# EAGLE board melzi (EAGLE 5.11)
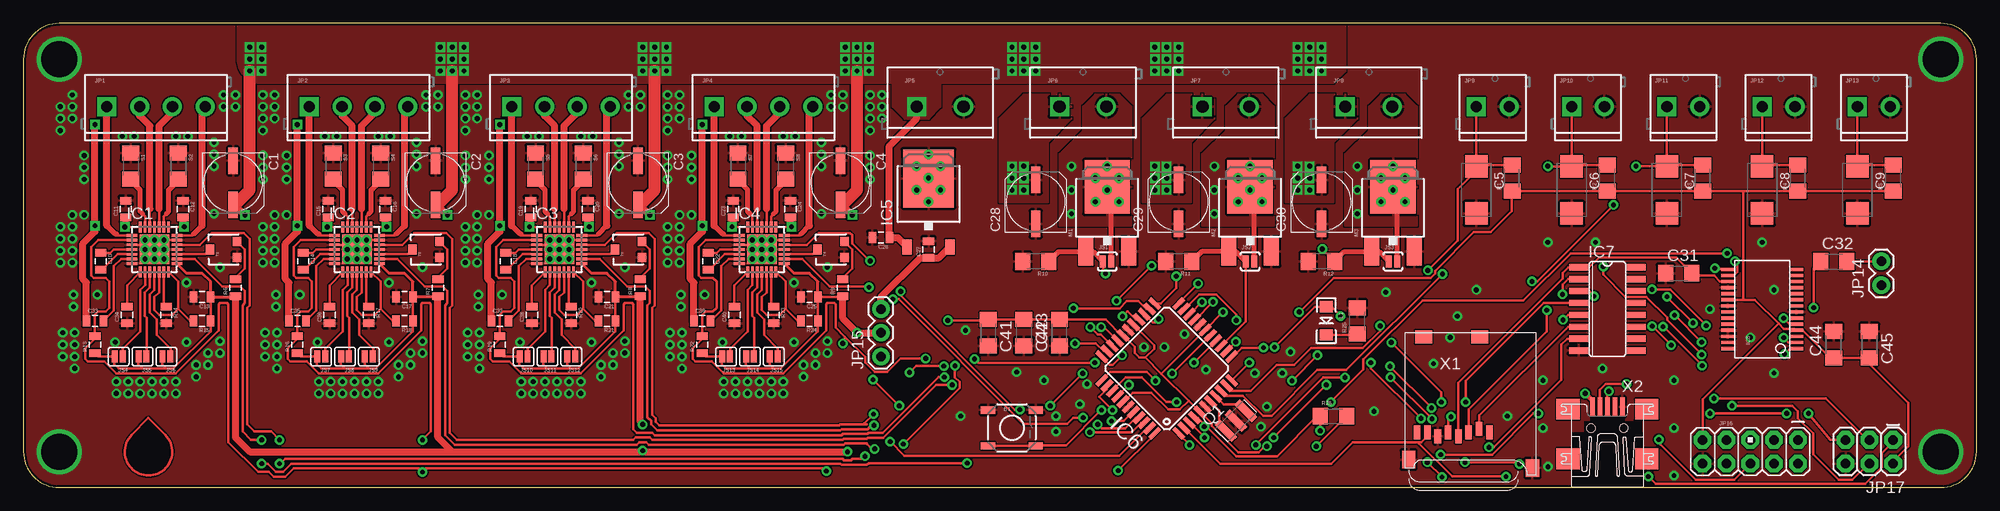
[diagram p1: board, top side]
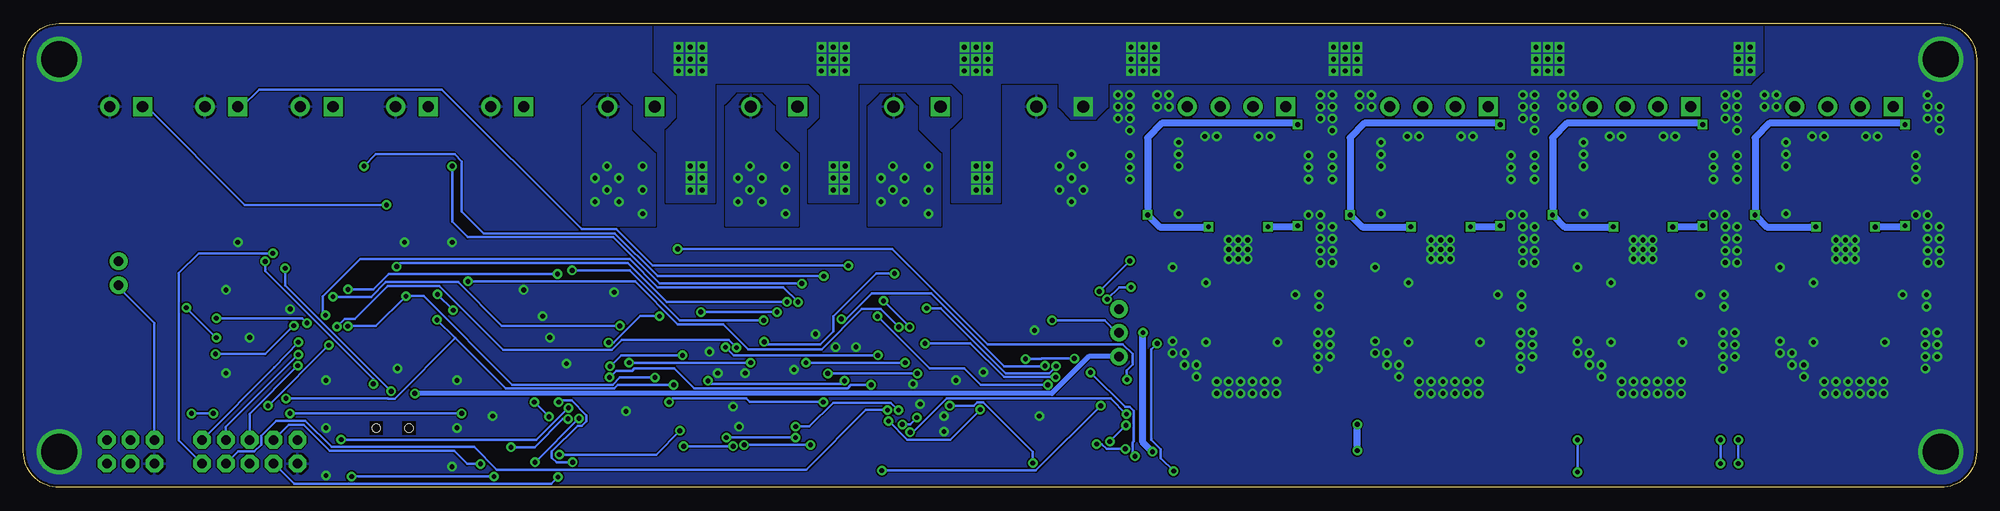
[diagram p2: board, bottom side, seen from below]

Size 208.28 x 49.53 mm. Coordinates in mm from the lower left corner, seen from the top.
Outline: 3.81,49.53 arc90 0,45.72 0,3.81 arc90 3.81,0 204.47,0 arc90 208.28,3.81 208.28,45.72 arc90 204.47,49.53 3.81,49.53
Copper layers (1*16): Top 0.035mm / dielectric 1.5mm / Bottom 0.035mm
Design rules "10width10space20drill10annular *": minimum track width 10mil, minimum drill 20mil, track to track 6mil, track to pad 6mil, pad to pad 7mil, via to via 6mil, smd to smd 0mil, copper to edge 10mil, drill to drill 10mil, minimum pad ring 10mil, minimum via ring 10mil, stop-mask expansion 2mil, vias tented up to drill 25mil, thermal gap 10mil
tRestrict: area 171.2,5.6 to 172.6,7.1; area 170,5.6 to 171.4,7.1; area 166.4,5.6 to 167.9,7.1
bRestrict: area 166.4,5.6 to 167.9,7.1; area 170,5.6 to 171.4,7.1

## Footprints (pad centres in the part's own frame; a part is rotated, then mirrored left to right if it is on the bottom)
TACTILE_SWITCH_SMD = smd 1.524 x 0.762: 1 -2.54,1.905; 2 2.54,1.905; 3 -2.54,-1.905; 4 2.54,-1.905
UD-6,3X7,7_NICHICON = smd 2.8 x 1: + 2.35,0; - -2.35,0
SMC_C = smd 2.4 x 2.4: + -2.5,0; - 2.5,0
0805 = smd 0.8 x 1.2: 1 -0.9,0; 2 0.9,0
C1206 = smd 1.6 x 1.8: 1 -1.4,0; 2 1.4,0
QFN28ET = smd 1.15 x 0.3: 1 -2.4,1.5; 2 -2.4,1; 3 -2.4,0.5; 4 -2.4,0; 5 -2.4,-0.5; 6 -2.4,-1; 7 -2.4,-1.5; 15 2.4,-1.5; 16 2.4,-1; 17 2.4,-0.5; 18 2.4,0; 19 2.4,0.5; 20 2.4,1; 21 2.4,1.5 | smd 0.3 x 1.15: 8 -1.5,-2.4; 9 -1,-2.4; 10 -0.5,-2.4; 11 0,-2.4; 12 0.5,-2.4; 13 1,-2.4; 14 1.5,-2.4; 22 1.5,2.4; 23 1,2.4; 24 0.5,2.4; 25 0,2.4; 26 -0.5,2.4; 27 -1,2.4; 28 -1.5,2.4 | smd 3.15 x 3.15: EXP 0,0
TO252 = smd 1 x 1.6: 1 -2.28,-4.8; 2 2.28,-4.8 | smd 5.4 x 6.2: 3 0,2.5
TQFP44 = smd 1.5 x 0.5: 1 -5.8,4; 2 -5.8,3.2; 3 -5.8,2.4; 4 -5.8,1.6; 5 -5.8,0.8; 6 -5.8,0; 7 -5.8,-0.8; 8 -5.8,-1.6; 9 -5.8,-2.4; 10 -5.8,-3.2; 11 -5.8,-4; 23 5.8,-4; 24 5.8,-3.2; 25 5.8,-2.4; 26 5.8,-1.6; 27 5.8,-0.8; 28 5.8,0; 29 5.8,0.8; 30 5.8,1.6; 31 5.8,2.4; 32 5.8,3.2; 33 5.8,4 | smd 0.5 x 1.5: 12 -4,-5.8; 13 -3.2,-5.8; 14 -2.4,-5.8; 15 -1.6,-5.8; 16 -0.8,-5.8; 17 0,-5.8; 18 0.8,-5.8; 19 1.6,-5.8; 20 2.4,-5.8; 21 3.2,-5.8; 22 4,-5.8; 34 4,5.8; 35 3.2,5.8; 36 2.4,5.8; 37 1.6,5.8; 38 0.8,5.8; 39 0,5.8; 40 -0.8,5.8; 41 -1.6,5.8; 42 -2.4,5.8; 43 -3.2,5.8; 44 -4,5.8
SO16 = smd 0.66 x 2.032: 1 -4.445,-3.073; 2 -3.175,-3.073; 3 -1.905,-3.073; 4 -0.635,-3.073; 5 0.635,-3.073; 6 1.905,-3.073; 7 3.175,-3.073; 8 4.445,-3.073; 9 4.445,3.073; 10 3.175,3.073; 11 1.905,3.073; 12 0.635,3.073; 13 -0.635,3.073; 14 -1.905,3.073; 15 -3.175,3.073; 16 -4.445,3.073
SSOP28DB = smd 0.348 x 1.397: 1 -4.225,-3.656; 2 -3.575,-3.656; 3 -2.925,-3.656; 4 -2.275,-3.656; 5 -1.625,-3.656; 6 -0.975,-3.656; 7 -0.325,-3.656; 8 0.325,-3.656; 9 0.975,-3.656; 10 1.625,-3.656; 11 2.275,-3.656; 12 2.925,-3.656; 13 3.575,-3.656; 14 4.225,-3.656; 15 4.225,3.656; 16 3.575,3.656; 17 2.925,3.656; 18 2.275,3.656; 19 1.625,3.656; 20 0.975,3.656; 21 0.325,3.656; 22 -0.325,3.656; 23 -0.975,3.656; 24 -1.625,3.656; 25 -2.275,3.656; 26 -2.925,3.656; 27 -3.575,3.656; 28 -4.225,3.656
SCREWTERMINAL-3.5MM-4 = drill 1.2 pad 2.032 square: 1 0,0 | drill 1.2 pad 2.032 round: 2 3.5,0; 3 7,0; 4 10.5,0
SCREWTERMINAL-5MM-2 = drill 1.3 pad 2.032 square: 1 0,0 | drill 1.3 pad 2.032 round: 2 5,0
SCREWTERMINAL-3.5MM-2 = drill 1.2 pad 2.032 square: 1 0,0 | drill 1.2 pad 2.032 round: 2 3.5,0
1X02 = drill 1.016 pad 1.88 round: 1 0,0; 2 2.54,0
1X03 = drill 1.016 pad 1.88 round: 1 0,0; 2 2.54,0; 3 5.08,0
AVR_ICSP = drill 1.016 pad 1.88 octagon: 1 -1.27,5.08; 2 1.27,5.08; 3 -1.27,2.54; 4 1.27,2.54; 5 -1.27,0; 6 1.27,0; 7 -1.27,-2.54; 8 1.27,-2.54; 9 -1.27,-5.08; 10 1.27,-5.08
2X3 = drill 1.016 pad 1.88 octagon: 1 0,0; 2 0,2.54; 3 2.54,0; 4 2.54,2.54; 5 5.08,0; 6 5.08,2.54
SJ_2S-NO = smd 0.635 x 1.27: 1 -0.45,0; 2 0.45,0
SJ_2S = smd 0.635 x 1.27: 1 -0.412,0; 2 0.412,0
LED-1206 = smd 1.2 x 1.4: A -1.5,0; C 1.5,0
DPAK = smd 1.6 x 3: 1 -2.28,-5.31; 3 2.28,-5.31 | smd 4.826 x 5.715: 4 0,1.588
CSTCR6M = smd 0.8 x 2.6: 1 -1.5,0; 2 0,0; 3 1.5,0
1206 = smd 1.6 x 1.8: 1 -1.4,0; 2 1.4,0
TRIMPOT-3MM = smd 1 x 0.9: 1 -0.85,-1.45; 3 0.85,-1.45 | smd 1.1 x 0.9: 2 0,1.45
MICROSD = smd 0.7 x 1.5: 1 9,-10.64; 2 7.9,-10.24; 3 6.8,-10.64; 4 5.7,-11.04; 5 4.6,-10.64; 6 3.5,-11.04; 7 2.4,-10.64; 8 1.3,-10.64 | smd 1.8 x 1.4: CD1 2,-0.44; CD2 8,-0.44 | smd 1.4 x 1.9: MT1 0.4,-13.54; MT2 13.6,-14.44
UX60-MB-5ST = smd 2 x 0.5: 1 2.25,1.6; 2 2.25,0.8; 3 2.25,0; 4 2.25,-0.8; 5 2.25,-1.6 | smd 2.2 x 2.5: M1 -3.3,-4.2; M2 -3.3,4.2; M3 2,4.2; M4 2,-4.2 | hole 0.9: 0,-1.75; 0,1.75

## Placement (x,y rotation side)
B1  RESET  [TACTILE_SWITCH_SMD]  105.41,6.35 0 top
C1  100 uF  [UD-6,3X7,7_NICHICON]  22.35,32.51 270 top
C2  100 uF  [UD-6,3X7,7_NICHICON]  43.94,32.51 270 top
C3  100 uF  [UD-6,3X7,7_NICHICON]  65.53,32.51 270 top
C4  100 uF  [UD-6,3X7,7_NICHICON]  87.12,32.51 270 top
C5  4.7 uF  [SMC_C]  154.94,31.75 270 top
C6  4.7 uF  [SMC_C]  165.1,31.75 270 top
C7  4.7 uF  [SMC_C]  175.26,31.75 270 top
C8  4.7 uF  [SMC_C]  185.42,31.75 270 top
C9  4.7 uF  [SMC_C]  195.58,31.75 270 top
C10  .1uf  [0805]  8.26,24.13 270 top
C11  .1uf  [0805]  10.92,29.72 90 top
C12  .1uf  [0805]  17.02,29.72 270 top
C13  .22uf  [0805]  19.05,20.32 180 top
C14  .1uf  [0805]  29.84,24.13 270 top
C15  .1uf  [0805]  32.51,29.72 90 top
C16  .1uf  [0805]  38.61,29.72 270 top
C17  .22uf  [0805]  40.64,20.32 180 top
C18  .1uf  [0805]  51.44,24.13 270 top
C19  .1uf  [0805]  54.1,29.72 90 top
C20  .1uf  [0805]  60.2,29.72 270 top
C21  .22uf  [0805]  62.23,20.32 180 top
C22  .1uf  [0805]  73.03,24.13 270 top
C23  .1uf  [0805]  75.69,29.72 90 top
C24  .1uf  [0805]  81.79,29.72 270 top
C25  .22uf  [0805]  83.82,20.32 180 top
C26  .33uf  [0805]  91.44,26.67 180 top
C27  .1uf  [0805]  96.52,25.4 90 top
C28  100 uF  [UD-6,3X7,7_NICHICON]  107.95,30.48 90 top
C29  100 uF  [UD-6,3X7,7_NICHICON]  123.19,30.48 90 top
C30  100 uF  [UD-6,3X7,7_NICHICON]  138.43,30.48 90 top
C31  0.1 uF  [C1206]  176.53,22.86 0 top
C32  0.1 uF  [C1206]  193.04,24.13 0 top
C33  .1uf  [0805]  7.62,17.78 0 top
C34  .22uf  [0805]  11.05,18.41 90 top
C35  .1uf  [0805]  29.21,17.78 0 top
C36  .22uf  [0805]  32.64,18.41 90 top
C37  .1uf  [0805]  50.8,17.78 0 top
C38  .22uf  [0805]  54.23,18.41 90 top
C39  .1uf  [0805]  72.39,17.78 0 top
C40  .22uf  [0805]  75.82,18.41 90 top
C41  1 uF  [C1206]  102.87,16.51 270 top
C42  1 uF  [C1206]  106.68,16.51 270 top
C43  0.1 uF  [C1206]  110.49,16.51 90 top
C44  0.1 uF  [C1206]  193.04,15.24 90 top
C45  0.33 uF  [C1206]  196.85,15.24 270 top
IC1  A4988  [QFN28ET]  13.97,25.4 0 top
IC2  A4988  [QFN28ET]  35.56,25.4 0 top
IC3  A4988  [QFN28ET]  57.15,25.4 0 top
IC4  A4988  [QFN28ET]  78.74,25.4 0 top
IC5  7805DT  [TO252]  96.52,30.48 0 top
IC6  ATMEGA644A  [TQFP44]  121.92,12.7 135 top
IC7  4050D  [SO16]  168.91,19.05 270 top
IC8  FT232RL-BASICSSOP  [SSOP28DB]  185.42,19.05 90 top
JP1  X-MOT  [SCREWTERMINAL-3.5MM-4]  8.89,40.64 0 top
JP2  Y-MOT  [SCREWTERMINAL-3.5MM-4]  30.48,40.64 0 top
JP3  Z-MOT  [SCREWTERMINAL-3.5MM-4]  52.07,40.64 0 top
JP4  Y-MOT  [SCREWTERMINAL-3.5MM-4]  73.66,40.64 0 top
JP5  PWR  [SCREWTERMINAL-5MM-2]  95.25,40.64 0 top
JP6  BED  [SCREWTERMINAL-5MM-2]  110.49,40.64 0 top
JP7  END  [SCREWTERMINAL-5MM-2]  125.73,40.64 0 top
JP8  FAN  [SCREWTERMINAL-5MM-2]  140.97,40.64 0 top
JP9  X-STOP  [SCREWTERMINAL-3.5MM-2]  154.94,40.64 0 top
JP10  Y-STOP  [SCREWTERMINAL-3.5MM-2]  165.1,40.64 0 top
JP11  Z-STOP  [SCREWTERMINAL-3.5MM-2]  175.26,40.64 0 top
JP12  BEDTEMP  [SCREWTERMINAL-3.5MM-2]  185.42,40.64 0 top
JP13  ENDTEMP  [SCREWTERMINAL-3.5MM-2]  195.58,40.64 0 top
JP14  AUTO-RST  [1X02]  198.12,21.59 90 top
JP15  VREG/USB  [1X03]  91.44,13.97 90 top
JP16  M05X2PTH  [AVR_ICSP]  184.15,3.81 270 top
JP17  AVR_SPI_PRG_6PTH  [2X3]  199.39,5.08 180 top
JS1  HOTBED_BYPASS  [SJ_2S-NO]  115.57,24.13 0 top
JS2  HOTEND_BYPASS  [SJ_2S-NO]  130.81,24.13 0 top
JS3  FAN_BYPASS  [SJ_2S-NO]  146.05,24.13 0 top
JS4  MS1  [SJ_2S]  10.16,13.97 180 top
JS5  MS2  [SJ_2S]  12.7,13.97 180 top
JS6  MS3  [SJ_2S]  15.24,13.97 180 top
JS7  MS1  [SJ_2S]  31.75,13.97 180 top
JS8  MS2  [SJ_2S]  34.29,13.97 180 top
JS9  MS3  [SJ_2S]  36.83,13.97 180 top
JS10  MS1  [SJ_2S]  53.34,13.97 180 top
JS11  MS2  [SJ_2S]  55.88,13.97 180 top
JS12  MS3  [SJ_2S]  58.42,13.97 180 top
JS13  MS1  [SJ_2S]  74.93,13.97 180 top
JS14  MS2  [SJ_2S]  77.47,13.97 180 top
JS15  MS3  [SJ_2S]  80.01,13.97 180 top
L1  DEBUG  [LED-1206]  138.94,17.78 270 top
M1  RFP30N06LE  [DPAK]  115.57,30.48 0 top
M2  RFP30N06LE  [DPAK]  130.81,30.48 0 top
M3  RFP30N06LE  [DPAK]  146.05,30.48 0 top
Q1  16MHZ  [CSTCR6M]  129.29,7.11 45 top
R1  10k  [1206]  158.75,33.02 90 top
R2  10k  [1206]  168.91,33.02 90 top
R3  10k  [1206]  179.07,33.02 90 top
R4  10k  [1206]  189.23,33.02 90 top
R5  10k  [1206]  199.39,33.02 90 top
R6  20k  [0805]  22.61,21.34 90 top
R7  20k  [0805]  44.2,21.34 90 top
R8  20k  [0805]  65.79,21.34 90 top
R9  20k  [0805]  87.38,21.34 90 top
R10  10k  [1206]  107.95,24.13 180 top
R11  10k  [1206]  123.19,24.13 180 top
R12  10k  [1206]  138.43,24.13 180 top
R13  100k  [0805]  7.62,15.24 90 top
R14  10k  [0805]  15.24,18.41 270 top
R15  10k  [0805]  19.05,17.78 180 top
R16  100k  [0805]  29.21,15.24 90 top
R17  10k  [0805]  36.83,18.41 270 top
R18  10k  [0805]  40.64,17.78 180 top
R19  100k  [0805]  50.8,15.24 90 top
R20  10k  [0805]  58.42,18.41 270 top
R21  10k  [0805]  62.23,17.78 180 top
R22  100k  [0805]  72.39,15.24 90 top
R23  10k  [0805]  80.01,18.41 270 top
R24  10k  [0805]  83.82,17.78 180 top
R25  1K  [1206]  142.24,17.78 90 top
R26  1K  [1206]  139.7,7.62 0 top
S1  0.05  [1206]  11.43,34.29 270 top
S2  0.05  [1206]  16.51,34.29 270 top
S3  0.05  [1206]  33.02,34.29 270 top
S4  0.05  [1206]  38.1,34.29 270 top
S5  0.05  [1206]  54.61,34.29 270 top
S6  0.05  [1206]  59.69,34.29 270 top
S7  0.05  [1206]  76.2,34.29 270 top
S8  0.05  [1206]  81.28,34.29 270 top
T1  TRIM  [TRIMPOT-3MM]  21.34,25.4 90 top
T2  TRIM  [TRIMPOT-3MM]  42.93,25.4 90 top
T3  TRIM  [TRIMPOT-3MM]  64.52,25.4 90 top
T4  TRIM  [TRIMPOT-3MM]  86.11,25.4 90 top
X1  MICROSD  [MICROSD]  147.32,16.51 0 top
X2  MINI-USB-SHIELD-UX60-MB-5ST  [UX60-MB-5ST]  168.91,6.35 90 top

## Tracks (layer width: path | path; a pad name or v marks a point on that pad's centre or on a via)
!FAN  (via drill 0.51)
  Top 0.254: v116.74,1.8 120.62,5.69 120.62,5.77 IC6.44 | v90.6,11.51 v93.4,8.71 | v138.51,25.45 139.65,24.31 R12.1
  Top 0.508: JS3.1 144.56,25.17 M3.1 140.87,25.17 R12.1
  Bottom 0.254: v116.74,1.8 100.31,1.8 v93.4,8.71 | v90.6,11.51 90.6,12.5 89.99,13.11 89.99,14.25 91.03,15.29 105.46,15.29 115.62,25.45 v138.51,25.45
!HOTBED  (via drill 0.51)
  Top 0.254: v129.29,15.54 128.29,14.55 IC6.13 | v115.39,22.84 115.14,23.09 115.14,23.9 JS1.1
  Top 0.508: JS1.1 114.08,25.17 M1.1 110.39,25.17 R10.1
  Bottom 0.254: v115.39,22.84 117.32,22.84 121.92,18.24 121.92,16.64 123.32,15.24 128.98,15.24 v129.29,15.54
!HOTEND
  Top 0.254: IC6.14 127.74,15.11 130.35,17.73 130.35,23.9 JS2.1
  Top 0.508: JS2.1 129.32,25.17 M2.1 125.63,25.17 R11.1
!RESET  (via drill 0.51)
  Top 0.254: B1.3 B1.4 108.05,4.52 111.23,4.52 v114.96,8.26 | 126.05,6.62 129.34,3.33 133.68,3.33 137.97,7.62 R26.1 138.28,7.52 v138.28,6.04 | 126.05,6.62 125.22,7.44 124.89,7.44 IC6.4 | v125.93,6.5 126.05,6.62 | JP17.5 192.66,5.08 v190.35,7.9 | v179.86,7.9 v188.04,7.9 | v161.54,7.9 161.01,7.9 156.62,3.5 v151.13,3.5
  Bottom 0.254: JP17.5 194.31,17.55 198.12,21.36 JP14.1 | v114.96,8.26 115.01,8.26 115.8,9.04 121.94,9.04 124.48,6.5 v125.93,6.5 | v188.04,7.9 v190.35,7.9 | v161.54,7.9 v179.86,7.9 | v151.13,3.5 140.82,3.5 v138.28,6.04
!XYEENABLE  (via drill 0.51, 0.51 pad 1.02)
  Top 0.254: IC2.2 29.57,26.4 28.83,25.65 28.83,22.61 29.08,22.35 30.35,22.35 30.73,21.97 30.73,19.18 30.35,18.8 29.59,18.8 29.21,18.41 R16.2 29.21,15.88 28.19,14.86 28.19,13.72 28.45,13.46 30.23,13.46 31.5,12.19 37.85,12.19 42.42,16.76 42.42,19.56 42.55,19.68 43.31,19.68 43.43,19.56 43.43,5.97 v42.55,5.08 | IC1.2 7.99,26.4 7.24,25.65 7.24,22.61 7.49,22.35 8.76,22.35 9.14,21.97 9.14,19.18 8.76,18.8 8,18.8 7.62,18.41 R13.2 7.62,15.88 6.6,14.86 6.6,13.72 6.86,13.46 8.64,13.46 9.91,12.19 16.26,12.19 20.83,16.76 20.83,19.56 20.95,19.68 21.72,19.68 21.84,19.56 21.84,4.83 25.02,1.65 26.16,1.65 26.67,1.14 27.94,1.14 28.83,2.03 42.16,2.03 v42.55,1.65 42.93,2.03 85.62,2.03 v85.62,1.75 | IC4.2 72.75,26.4 72.01,25.65 72.01,22.61 72.26,22.35 73.53,22.35 73.91,21.97 73.91,19.18 73.53,18.8 72.77,18.8 72.39,18.41 R22.2 72.39,15.88 71.37,14.86 71.37,13.72 71.63,13.46 73.41,13.46 74.68,12.19 81.03,12.19 85.6,16.76 85.6,19.56 85.72,19.68 86.49,19.68 86.61,19.56 86.61,17.07 87.59,16.09 | v124.82,13.31 127.15,15.65 IC6.15 | v114.25,13.31 101.83,13.31 v101.42,13.72 | v96.22,13.77 93.55,13.77 92.1,12.32 90.78,12.32 89.76,13.34 89.76,13.92 87.59,16.09 | v87.38,15.37 87.59,15.15 87.59,16.09
  Bottom 0.254: v42.55,1.65 v42.55,5.08 | v114.25,13.31 v124.82,13.31 | v101.42,13.72 99.72,13.72 99.67,13.77 v96.22,13.77 | v85.62,1.75 87,3.12 87,4.06 88.01,5.08 88.01,14.73 v87.38,15.37
!ZENABLE  (via drill 0.51)
  Top 0.254: IC3.2 51.16,26.4 50.42,25.65 50.42,22.61 50.67,22.35 51.94,22.35 52.32,21.97 52.32,19.18 51.94,18.8 51.18,18.8 50.8,18.41 R19.2 50.8,15.88 49.78,14.86 49.78,13.72 50.04,13.46 51.82,13.46 53.09,12.19 59.44,12.19 64.01,16.76 64.01,19.56 64.14,19.68 64.9,19.68 65.02,19.56 65.02,6.22 65.41,5.84 67.06,5.84 67.31,5.59 87.25,5.59 87.38,5.71 90.02,5.71 90.09,5.82 91.62,5.82 97.59,11.79 v98.2,11.79 | v112.14,15.37 114.38,15.37 115.19,14.55 115.55,14.55 IC6.32
  Bottom 0.254: v112.14,15.37 107.29,15.37 103.71,11.79 v98.2,11.79
AIFO  (via drill 0.51)
  Top 0.254: v187.81,14.25 188.37,14.81 189.05,14.81 IC8.1 | v179.45,17.27 175.59,21.13 v173.66,21.13 | v151.33,22.78 141.07,12.52 138,12.52 133.1,7.62 132.21,7.62 130.05,9.78 128.24,9.78 IC6.9 127.71,10.29
  Bottom 0.254: v187.81,14.25 182.47,14.25 v179.45,17.27 | v173.66,21.13 170.99,21.13 169.34,22.78 v151.33,22.78
AOFI  (via drill 0.51)
  Top 0.254: v187.71,18.06 188.32,17.45 189.05,17.45 IC8.5 | v175.26,20.34 v178.05,17.55 | v144.68,17.25 144.68,16.71 142.85,14.88 137.31,14.88 135.51,13.08 133.66,13.08 130.86,10.29 128.88,10.29 128.29,10.87 IC6.10
  Bottom 0.254: v187.71,18.06 178.56,18.06 v178.05,17.55 | v175.26,20.34 171.2,20.34 169.62,21.92 161.93,21.92 157.25,17.25 v144.68,17.25
BEDTEMP  (via drill 0.51)
  Top 0.254: JP12.1 C8.+ 185.42,34.42 R4.2 | v113.77,17.12 114.55,16.33 114.88,16.33 116.1,15.11 IC6.31 | v116.56,19.91 v120.32,23.67
  Bottom 0.254: v113.77,17.12 v116.56,19.91 | v120.32,23.67 141.17,23.67 145.06,27.56 148.77,27.56 163.68,42.47 183.16,42.47 184.99,40.64 JP12.1
DTR  (via drill 0.51)
  Top 0.254: v187.71,15.98 188.19,15.49 189.05,15.49 IC8.2 | v190.91,19.18 190.91,23.39 C32.1
  Bottom 0.254: v187.71,15.98 v190.91,19.18
E-DIR  (via drill 0.51)
  Top 0.254: IC4.19 83.56,25.9 84.84,27.18 88.14,27.18 88.39,26.92 88.39,26.04 90.17,24.26 90.27,24.18 v90.3,24.18 | v116.03,7.09 117.32,7.09 118.26,8.03 118.36,8.03 IC6.40 | v106.25,8.31 105.72,8.31 93.55,20.47 v93.55,20.93
  Bottom 0.254: v116.03,7.09 114.05,5.11 109.45,5.11 v106.25,8.31 | v90.3,24.18 v93.55,20.93
E-STEP  (via drill 0.51)
  Top 0.254: IC4.16 83.04,24.4 85.98,21.46 90.04,21.46 90.14,21.39 v90.17,21.36 | v114.55,6.73 114.99,6.3 117.47,6.3 118.62,7.44 118.95,7.44 IC6.41 | v113,7.44 111.94,7.44 111.3,6.81 106.63,6.81 93.34,20.09 v92.71,20.09
  Bottom 0.254: v114.55,6.73 113.72,6.73 v113,7.44 | v92.71,20.09 91.44,21.36 v90.17,21.36
ENDTEMP  (via drill 0.51)
  Top 0.254: JP13.1 C9.+ 195.58,34.42 R5.2 | v114.94,17.12 115.21,17.12 116.66,15.67 IC6.30 | v160.88,22 161.42,22 v169.57,30.15
  Bottom 0.254: v114.94,17.12 116.86,19.05 118.87,19.05 123.17,14.76 130.96,14.76 133.63,17.42 138.48,17.42 143.05,22 v160.88,22 | v169.57,30.15 184.66,30.15 195.15,40.64 JP13.1
EOUT1A
  Top 0.254: IC4.24 79.24,29.73
  Top 0.762: JP4.3 80.66,40.02 79.24,38.6 79.24,29.73
EOUT1B
  Top 0.254: IC4.21 82.78,26.9 82.93,27.05
  Top 0.508: 82.93,27.05 83.82,27.94
  Top 0.762: JP4.4 83.82,40.64 83.82,27.94
EOUT2A
  Top 0.254: IC4.26 78.24,29.73
  Top 0.762: JP4.2 77.16,39.68 78.24,38.6 78.24,29.73
EOUT2B
  Top 0.254: IC4.1 74.83,26.9 74.68,27.05
  Top 0.508: 74.68,27.05 74.55,27.05 73.66,27.94
  Top 0.762: 73.66,27.94 JP4.1
EXT-A1  (via drill 0.51)
  Top 0.254: v122.99,9.12 121.87,9.12 119.25,11.73 117.55,11.73 116.13,10.31 IC6.36 | v139.42,9.12 142.9,12.6 142.9,13.64 149.2,19.94 159.94,19.94 165,24.99 v181.69,24.99
  Bottom 0.254: v122.99,9.12 130.84,9.12 131.22,9.5 139.04,9.5 v139.42,9.12 | v181.69,24.99 189.59,24.99 191.69,22.89 191.69,5 JP16.2
EXT-A2  (via drill 0.51)
  Top 0.254: v116.13,8.26 114.73,9.65 114.73,9.68 115.55,10.49 115.55,10.85 IC6.35
  Bottom 0.254: v116.13,8.26 118.47,8.26 124.82,1.91 157.81,1.91 160.22,4.32 175.41,4.32 178.21,7.11 181.31,7.11 182.93,5.49 182.93,4.57 183.64,3.86 185.37,3.86 JP16.4
EXT-A3  (via drill 0.51)
  Top 0.254: v120.73,11.38 119.79,12.32 115.9,12.32 115.01,11.43 IC6.34 | v135.28,11.38 v138,14.1 | v145.72,12.93 v150.16,8.48 | v174.4,5.11 174.55,4.95 174.55,4.6 178.33,0.81 182.42,0.81 JP16.6
  Bottom 0.254: v138,14.1 144.55,14.1 v145.72,12.93 | v150.16,8.48 153.57,5.08 174.37,5.08 v174.4,5.11 | v135.28,11.38 134.95,11.05 121.06,11.05 v120.73,11.38
EXT-A4  (via drill 0.51)
  Top 0.254: v133.4,14.96 137.72,19.28 L1.A 139.04,19.2 139.55,19.2 v140.46,18.29 | v117.17,14.1 116.15,13.08 115.82,13.08 115.01,13.89 115.01,13.97 IC6.33 | v149.71,2.69 v151.28,1.12 | v151.21,9.12 151.21,10.13 v145.87,15.47
  Bottom 0.254: v133.4,14.96 132.54,14.1 v117.17,14.1 | JP16.8 181.53,2.54 179.38,0.38 152.02,0.38 v151.28,1.12 | v149.71,2.69 151.44,2.69 151.92,3.17 151.92,3.83 149.17,6.58 148.72,6.58 148.26,7.04 148.26,7.7 149.84,9.27 151.05,9.27 v151.21,9.12 | v145.87,15.47 145.34,15.47 142.52,18.29 v140.46,18.29
EXT-RX1  (via drill 0.51)
  Top 0.254: v130.73,13.31 IC6.11 | v143.69,13.31 143.69,12.72 v149.05,7.37 | v153.72,2.69 159.36,2.69 v159.54,2.52
  Bottom 0.254: v130.73,13.31 v143.69,13.31 | v149.05,7.37 v153.72,2.69 | v159.54,2.52 160.96,2.52 162.36,3.91 175.59,3.91 178.38,6.71 179.98,6.71 JP16.7
EXT-SCL  (via drill 0.51)
  Top 0.254: v126.85,19.81 124.99,17.96 124.89,17.96 IC6.19 | v168.48,23.57 168.48,22.71 170.84,20.34 173.08,20.34 175.28,18.14 175.28,17.86 v178.97,14.17
  Bottom 0.254: v126.85,19.81 139.68,19.81 143.81,23.95 168.1,23.95 v168.48,23.57 | v178.97,14.17 186.69,6.45 JP16.3
EXT-SDA  (via drill 0.51)
  Top 0.254: v125.68,19.79 124.41,18.52 124.33,18.52 IC6.20 | v176.07,18.39 v178.97,15.49
  Bottom 0.254: v125.68,19.79 127.25,21.36 140.61,21.36 143.61,24.36 172.36,24.36 176.35,20.37 176.35,18.67 v176.07,18.39 | v178.97,15.49 181.51,12.8 JP16.1
EXT-TX1  (via drill 0.51)
  Top 0.254: v132.23,14.91 129.95,14.91 129.03,13.99 128.85,13.99 IC6.12 | v174.85,17.17 v179.02,13.01
  Bottom 0.254: v132.23,14.91 133.07,15.75 144.47,15.75 145.54,14.68 157.1,14.68 163.93,21.51 169.44,21.51 172.95,18.01 174.01,18.01 v174.85,17.17 | v179.02,13.01 184.15,7.87 JP16.5
GND  (via drill 0.51 pad 1.02, 3.81 pad 1.02)
  Top 0.254: v12.95,25.4 12.45,25.9 IC1.3 | v14.99,26.42 16.38,26.42 | v34.54,25.4 34.04,25.9 IC2.3 | v36.58,26.42 37.97,26.42 | v77.72,25.4 77.22,25.9 IC4.3 | v79.76,26.42 81.15,26.42 81.15,26.41 IC4.20 | v56.13,25.4 55.63,25.9 IC3.3 | v58.17,26.42 59.56,26.42 | IC1.7 11.59,23.88
  other vias: 13.97,26.42 12.95,26.42 12.95,24.38 14.99,24.38 13.97,24.38 13.97,25.4 14.99,25.4 35.56,26.42 34.54,26.42 34.54,24.38 36.58,24.38 35.56,24.38 35.56,25.4 36.58,25.4 78.74,26.42 77.72,26.42 77.72,24.38 79.76,24.38 78.74,24.38 78.74,25.4 79.76,25.4 82.17,21.84 57.15,26.42 56.13,26.42 56.13,24.38 58.17,24.38 57.15,24.38 57.15,25.4 58.17,25.4 20.32,29.21 20.32,35.56 20.32,36.83 41.91,29.21 41.91,35.56 41.91,36.83 63.5,29.21 63.5,35.56 63.5,36.83 85.09,29.21 85.09,35.56 85.09,36.83 96.52,33.02 95.25,34.29 97.79,34.29 95.25,31.75 97.79,31.75 96.52,30.48 96.52,35.56 44.2,40.64 44.2,41.91 65.79,40.64 65.79,41.91 87.38,40.64 87.38,41.91 20.95,23.5 42.55,23.5 64.14,23.5 85.72,23.5 60.58,21.84 38.99,21.84 17.4,21.84 9.78,15.49 31.37,15.49 52.96,15.49 74.55,15.49 38.99,15.49 60.58,15.49 82.17,15.49 17.4,15.49 22.61,41.91 22.61,40.64 3.81,45.72 3.81,3.81 79.76,11.3 78.49,11.3 77.22,11.3 75.95,11.3 74.68,11.3 81.03,11.3 79.76,10.03 78.49,10.03 77.22,10.03 75.95,10.03 74.68,10.03 81.03,10.03 14.99,11.3 13.72,11.3 12.45,11.3 11.18,11.3 9.91,11.3 16.26,11.3 14.99,10.03 13.72,10.03 12.45,10.03 11.18,10.03 9.91,10.03 16.26,10.03 36.58,11.3 35.31,11.3 34.04,11.3 32.77,11.3 31.5,11.3 37.85,11.3 36.58,10.03 35.31,10.03 34.04,10.03 32.77,10.03 31.5,10.03 37.85,10.03 58.17,11.3 56.9,11.3 55.63,11.3 54.36,11.3 53.09,11.3 59.44,11.3 58.17,10.03 56.9,10.03 55.63,10.03 54.36,10.03 53.09,10.03 59.44,10.03 85.72,15.62 85.72,14.35 84.45,14.35 84.45,13.08 83.19,13.08 83.19,11.81 20.95,15.62 20.95,14.35 19.68,14.35 19.68,13.08 18.41,13.08 18.41,11.81 42.55,15.62 42.55,14.35 41.27,14.35 41.27,13.08 40.01,13.08 40.01,11.81 64.14,15.62 64.14,14.35 62.87,14.35 62.87,13.08 61.59,13.08 61.59,11.81 70.23,16.51 70.23,15.24 70.23,13.97 70.23,12.7 68.96,16.51 68.96,15.24 68.96,13.97 5.46,16.51 5.46,15.24 5.46,13.97 5.46,12.7 4.19,16.51 4.19,15.24 4.19,13.97 27.05,16.51 27.05,15.24 27.05,13.97 27.05,12.7 25.78,16.51 25.78,15.24 25.78,13.97 48.64,16.51 48.64,15.24 48.64,13.97 48.64,12.7 47.37,16.51 47.37,15.24 47.37,13.97 25.53,41.91 25.53,40.64 90.3,41.91 90.3,40.64 68.71,41.91 68.71,40.64 47.12,41.91 47.12,40.64 48.39,41.91 48.39,40.64 69.98,41.91 69.98,40.64 26.8,41.91 26.8,40.64 91.57,41.91 91.57,40.64 68.71,39.37 90.3,39.37 47.12,39.37 25.53,39.37 25.53,38.1 26.8,39.37 47.12,38.1 48.39,39.37 68.71,38.1 69.98,39.37 90.3,38.1 91.57,39.37 86.11,41.91 86.11,40.64 64.52,40.64 64.52,41.91 42.93,40.64 42.93,41.91 21.34,40.64 21.34,41.91 3.94,40.64 5.21,41.91 5.21,40.64 3.94,39.37 3.94,38.1 5.21,39.37 63.5,34.29 41.91,34.29 20.32,34.29 85.09,34.29 3.94,27.81 25.53,27.81 47.12,27.81 68.71,27.81 69.98,29.08 68.71,26.54 48.39,29.08 47.12,26.54 26.8,29.08 25.53,26.54 5.21,29.08 3.94,26.54 204.47,45.72 204.47,3.81 121.67,14.99 113.41,11.05 100.46,16.76 105.92,12.32 108.84,11.43 99.95,7.62 112.65,8.89 110.11,7.62 110.11,5.97 126.11,12.57 119.51,14.99 123.83,16.38 131.95,6.48 144.02,8.13 135.13,14.48 150.37,13.21 152.91,18.29 145.29,20.83 152.15,16 154.94,21.08 186.69,21.08 179.83,19.05 162.56,26.16 167.64,26.16 134.24,12.19 131.32,12.19 132.59,8.64 25.53,25.27 25.53,24 3.94,25.27 3.94,24 47.12,25.27 47.12,24 68.71,25.27 68.71,24 49.66,29.08 48.39,27.81 48.39,26.54 48.39,25.27 48.39,24 6.48,29.08 5.21,27.81 5.21,26.54 5.21,25.27 5.21,24 26.8,24 26.8,25.27 26.8,26.54 26.8,27.81 28.07,29.08 69.98,24 69.98,25.27 69.98,26.54 69.98,27.81 71.25,29.08 7.87,20.57 29.46,20.57 51.05,20.57 72.64,20.57 48.51,20.57 48.51,19.3 70.1,19.3 70.1,20.57 26.92,20.57 26.92,19.3 5.33,20.57 5.33,19.3 28.07,35.43 28.07,34.16 28.07,32.89 6.48,32.89 6.48,34.16 6.48,35.43 49.66,35.43 49.66,34.16 49.66,32.89 71.25,32.89 71.25,34.16 71.25,35.43 68.71,34.16 68.71,35.43 68.71,32.89 90.3,32.89 90.3,34.16 90.3,35.43 47.12,35.43 47.12,34.16 47.12,32.89 25.53,35.43 25.53,34.16 25.53,32.89 10.54,37.47 11.81,37.47 17.53,37.47 16.26,37.47 32.13,37.47 33.4,37.47 53.72,37.47 54.99,37.47 75.31,37.47 76.58,37.47 37.85,37.47 39.12,37.47 59.44,37.47 60.71,37.47 81.03,37.47 82.3,37.47 176.02,11.43 168.4,12.7 162.05,11.43 158.24,7.62 162.05,6.35 176.02,1.27 176.02,6.35 185.42,26.16 186.69,12.19 184.15,16 162.59,2.21
  pour Bottom (rank 6): -3.81,53.34 212.09,53.34 212.09,-3.81 -3.81,-3.81
  pour Top (rank 6): -5.08,54.61 -5.08,-5.08 165.1,-5.08 172.72,-5.08 213.36,-5.08 213.36,54.61
HOTBED-GND  (via drill 0.51 pad 1.02)
  Top 0.254: M1.4 116.02,31.62
  Top 0.508: JS1.2 116.02,29.66 v116.84,30.48
  other vias: 114.3,33.02 114.3,30.48 115.57,34.29 116.84,33.02 111.76,34.29 111.76,31.75 111.76,29.21 115.57,31.75
  pour Top: 118.11,27.94 110.49,27.94 110.49,35.56 113.03,38.1 113.03,40.64 114.3,41.91 116.84,41.91 118.11,40.64
  pour Bottom: 110.49,27.94 118.11,27.94 118.11,40.64 116.84,41.91 114.3,41.91 113.03,40.64 113.03,38.1 110.49,35.56
HOTBED-GND1  (via drill 0.51 pad 1.02)
  Top 0.254: M2.4 131.26,31.62
  Top 0.508: JS2.2 131.26,29.66 v132.08,30.48
  other vias: 130.81,34.29 129.54,33.02 132.08,33.02 129.54,30.48 127,34.29 127,31.75 127,29.21 130.81,31.75
  pour Top: 125.73,27.94 133.35,27.94 133.35,40.64 132.08,41.91 129.54,41.91 128.27,40.64 128.27,38.1 125.73,35.56
  pour Bottom: 125.73,27.94 133.35,27.94 133.35,40.64 132.08,41.91 129.54,41.91 128.27,40.64 128.27,38.1 125.73,35.56
HOTBED-GND2  (via drill 0.51 pad 1.02)
  Top 0.254: M3.4 146.5,31.62
  Top 0.508: JS3.2 146.5,29.66 v147.32,30.48
  other vias: 146.05,34.29 144.78,33.02 147.32,33.02 144.78,30.48 142.24,34.29 142.24,31.75 142.24,29.21 146.05,31.75
  pour Top: 148.59,27.94 140.97,27.94 140.97,35.56 143.51,38.1 143.51,40.64 144.78,41.91 147.32,41.91 148.59,40.64
  pour Bottom: 140.97,27.94 148.59,27.94 148.59,40.64 147.32,41.91 144.78,41.91 143.51,40.64 143.51,38.1 140.97,35.56
MISO  (via drill 0.51)
  Top 0.254: 148.79,4.83 149.07,4.83 149.71,5.46 149.71,5.87 X1.7 | 148.79,4.83 141.73,4.83 139.45,2.54 127.64,2.54 123.85,6.33 123.77,6.33 IC6.2 | JP17.1 199.39,4.85 198.17,3.63 198.17,2.13 196.42,0.38 174.07,0.38 v173.28,1.17 | v158.09,1.17 152.35,1.17 148.79,4.72 148.79,4.83
  Bottom 0.254: v158.09,1.17 v173.28,1.17
MOSI  (via drill 0.51)
  Top 0.254: v124.36,4.55 123.22,5.69 123.22,5.77 IC6.1 | v131.42,4.55 138.61,11.73 v140.92,11.73 | v167.49,20.42 166.95,20.95 IC7.3 | JP17.4 196.77,2.54 195.05,0.81 193.57,0.81 190.86,3.53 190.86,5.77 189.23,7.39 189.23,8.13 188.65,8.71 v182.19,8.71 | v173.69,17.22 v175.72,15.19
  Bottom 0.254: v124.36,4.55 v131.42,4.55 | v140.92,11.73 144.68,11.73 145.44,10.97 156.16,10.97 165.61,20.42 v167.49,20.42 167.59,20.34 170.71,17.22 v173.69,17.22 | v175.72,15.19 v182.19,8.71
N$1
  Top 0.254: 11.54,5.61 arc270 15.13,5.61 13.34,7.4 11.54,5.61
N$2
  Top 0.254: L1.C 142.16,16.28 142.24,16.36 R25.1
N$3
  Top 0.254: IC1.9 12.97,21.61 12.45,21.08 12.45,16.64 10.61,14.8 10.61,14.01 JS4.1
N$11
  Top 0.254: IC2.10 35.06,21.34 34.54,20.83 34.54,18.29 34.74,18.09 34.74,14.01 JS8.1
N$12  (via drill 0.51)
  Top 0.254: v162.46,18.92 162.46,16.66 154.13,8.33 154.13,5.89 X1.3 | v164.13,20.6 164.13,21.64 164.72,22.23 IC7.2
  Bottom 0.254: v162.46,18.92 v164.13,20.6
N$13  (via drill 0.51)
  Top 0.254: v152.22,7.54 151.94,7.26 151.94,5.89 X1.5 | v153.8,9.12 153.8,11.38 162.13,19.71 165.81,19.71 IC7.4
  Bottom 0.254: v152.22,7.54 v153.8,9.12
N$14
  Top 0.254: IC7.6 164.72,17.14 155.25,7.67 155.25,6.27 X1.2
N$15
  Top 0.762: IC5.2 97.62,24.5 C27.1 95.62,24.5 91.44,20.32 JP15.3
N$16
  Top 0.254: IC2.11 35.56,21.08 35.05,20.57 35.05,18.67 35.81,17.91 35.81,16.26 37.28,14.79 37.28,14.01 JS9.1
N$17
  Top 0.254: IC2.9 34.56,21.61 34.04,21.08 34.04,16.64 32.2,14.8 32.2,14.01 JS7.1
N$18
  Top 0.254: IC1.11 13.97,21.08 13.46,20.57 13.46,18.67 14.22,17.91 14.22,16.26 15.69,14.79 15.69,14.01 JS6.1
N$19
  Top 0.254: IC1.10 13.47,21.34 12.95,20.83 12.95,18.29 13.15,18.09 13.15,14.01 JS5.1
N$20
  Top 0.254: IC3.9 56.15,21.61 55.63,21.08 55.63,16.64 53.79,14.8 53.79,14.01 JS10.1
N$21
  Top 0.254: IC3.10 56.65,21.34 56.13,20.83 56.13,18.29 56.33,18.09 56.33,14.01 JS11.1
N$22
  Top 0.254: IC3.11 57.15,21.08 56.64,20.57 56.64,18.67 57.4,17.91 57.4,16.26 58.87,14.79 58.87,14.01 JS12.1
N$24
  Top 0.254: IC4.10 78.24,21.34 77.72,20.83 77.72,18.29 77.92,18.09 77.92,14.01 JS14.1
N$25
  Top 0.254: IC4.11 78.74,21.08 78.23,20.57 78.23,18.67 78.99,17.91 78.99,16.26 80.46,14.79 80.46,14.01 JS15.1
N$26
  Top 0.254: C32.2 JP14.2
N$27
  Top 0.254: IC4.9 77.74,21.61 77.22,21.08 77.22,16.64 75.38,14.8 75.38,14.01 JS13.1
N$28
  Top 0.254: IC6.7 127.51,8.24 127.51,6.86 128.22,6.14 Q1.1
N$29
  Top 0.254: 129.54,8.89 129.69,8.89 | 129.54,8.89 130.26,8.17 Q1.3 | IC6.8 127.99,8.89 129.54,8.89
SCLK  (via drill 0.51)
  Top 0.254: v125.96,5.33 124.41,6.88 124.33,6.88 IC6.3 | v133.32,5.33 v138.94,10.95 | v164.19,17.88 164.72,18.41 IC7.5 | JP17.3 196.62,5.08 192.2,9.5 v180.29,9.5
  Bottom 0.254: v125.96,5.33 v133.32,5.33 | v138.94,10.95 144.88,10.95 145.26,10.57 156.87,10.57 162.24,15.94 | 162.24,15.94 v164.19,17.88 | v180.29,9.5 169.42,9.5 169.39,9.47 168.71,9.47 162.24,15.94
SD-SS  (via drill 0.51)
  Top 0.254: v117.88,10.95 116.69,9.75 IC6.37 | v145.77,11.76 v150.22,7.32 | v156.29,4.29 156.82,4.29 164.01,11.48 164.01,15.24 164.64,15.88 IC7.7
  Bottom 0.254: v117.88,10.95 120.04,10.95 120.4,10.59 136.75,10.59 138.86,12.7 143.13,12.7 143.38,12.45 145.09,12.45 v145.77,11.76 | v150.22,7.32 150.75,7.32 153.77,4.29 v156.29,4.29
USBDM  (via drill 0.51)
  Top 0.254: v182.5,24.13 182.75,23.88 182.75,22.99 182.4,22.63 181.79,22.63 IC8.16 | v170.97,11.05 168.73,11.05 168.12,10.44 168.12,8.61 X2.2
  Bottom 0.254: v182.5,24.13 182.5,23.11 170.97,11.58 v170.97,11.05
USBDP  (via drill 0.51)
  Top 0.254: v180.37,23.39 180.47,23.29 181.76,23.29 IC8.15 | v169.06,10.26 168.88,10.08 168.88,8.64 168.91,8.61 X2.3
  Bottom 0.254: v180.37,23.39 180.37,21.57 v169.06,10.26
UVCC  (via drill 0.51)
  Top 0.254: 167.34,9.25 167.34,8.61 X2.1
  Top 0.483: v166.55,10.03 167.34,9.25
  Bottom 0.508: v166.55,10.03 98.6,10.03 94.67,13.97 JP15.1
VCC  (via drill 0.51, 0.51 pad 1.02)
  Top 0.254: R15.1 C13.1 | 12.7,12.7 10.16,12.7 9.71,13.15 9.71,13.93 JS4.2 7.99,13.97 R13.1 | 12.7,12.7 15.24,12.7 | R15.1 19.95,17.41 | 12.7,12.7 12.25,13.15 12.25,13.93 JS5.2 | 15.24,12.7 14.79,13.15 14.79,13.93 JS6.2 | 15.24,12.7 16,12.7 19.95,16.65 R15.1 | C17.1 R18.1 | 34.29,12.7 31.75,12.7 31.3,13.15 31.3,13.93 JS7.2 29.58,13.97 R16.1 | 36.83,12.7 34.29,12.7 | R18.1 41.54,17.41 | 34.29,12.7 33.84,13.15 33.84,13.93 JS8.2 | 36.83,12.7 36.38,13.15 36.38,13.93 JS9.2 | 36.83,12.7 37.59,12.7 41.54,16.65 R18.1 | C21.1 R21.1 | 55.88,12.7 53.34,12.7 52.89,13.15 52.89,13.93 JS10.2 51.17,13.97 R19.1 | 58.42,12.7 55.88,12.7 | R21.1 63.13,17.41 | 55.88,12.7 55.43,13.15 55.43,13.93 JS11.2 | 58.42,12.7 57.97,13.15 57.97,13.93 JS12.2 | 58.42,12.7 59.18,12.7 63.13,16.65 R21.1 | R24.1 C25.1 87.26,20.32 R9.1 | 77.47,12.7 74.93,12.7 74.48,13.15 74.48,13.93 JS13.2 72.76,13.97 R22.1 | 80.01,12.7 77.47,12.7 | R24.1 84.72,17.41 | 77.47,12.7 77.02,13.15 77.02,13.93 JS14.2 | 80.01,12.7 79.56,13.15 79.56,13.93 JS15.2 | 80.01,12.7 80.77,12.7 84.72,16.65 R24.1 | 119.65,13.86 121.36,12.14 | 121.36,12.14 124.24,9.26 | 124.24,9.26 125.45,8.05 IC6.5 125.55,8 126.72,6.83 126.72,6.58 129.54,3.76 131.75,3.76 132.38,4.39 v132.59,4.39 | IC6.38 117.27,9.17 117.37,9.17 118.31,10.11 120.29,10.11 122.07,8.33 123.32,8.33 124.24,9.26 | 118.39,17.25 118.39,17.35 IC6.27 120.6,15.15 120.6,14.81 119.65,13.86 | 121.36,12.14 IC6.17 126.09,16.89 v127.91,18.72 | v137.87,4.39 R26.2 | v98.58,17.83 102.77,17.83 C41.1 C42.1 106.78,17.91 C43.2 110.59,17.91 115.42,17.91 117.14,16.18 IC6.29 117.27,16.23 118.49,15.01 118.49,14.35 118.99,13.86 119.65,13.86
  Top 0.254: R3.1 179.17,31.62 | 183.39,31.62 R4.1 189.33,31.62 R5.1 | 183.39,20.02 184.63,20.02 187.16,17.49 | 183.39,20.02 181.79,20.02 IC8.20 | 187.16,17.49 187.73,16.92 188.85,16.92 188.95,16.82 IC8.4 189.08,16.76 189.76,16.76 192.68,13.84 C44.1 193.14,13.84 C45.2 196.29,13.74 201.02,9.02 201.02,4.39 199.39,2.77 JP17.2 | JP16.9 179.07,9.4 187.16,17.49 | 183.39,31.62 183.39,20.02 | v136.04,18.72 136.09,18.72 139.75,22.38 150.09,22.38 150.55,22.84 150.55,23.11 154.69,27.25 156.46,27.25 158.7,29.49 158.7,31.5 R1.1 R2.1 169.01,31.62 R3.1 | R3.1 183.39,31.62
  Top 0.305: IC1.15 17.41,22.86 19.05,22.86 19.95,21.96 C13.1 22.49,20.32 R6.1 | IC2.15 39,22.86 40.64,22.86 41.54,21.96 C17.1 44.08,20.32 R7.1 | IC3.15 60.59,22.86 62.23,22.86 63.13,21.96 C21.1 65.67,20.32 R8.1 | IC4.15 82.18,22.86 83.82,22.86 84.72,21.96 C25.1
  Top 0.762: 45.72,3.81 24.13,3.81 22.61,5.33 R6.1 | R7.1 44.2,5.33 45.72,3.81 | R8.1 65.79,6.99 v66.04,6.73 | R9.1 87.38,18.03 v88.9,16.51 JP15.2 | 45.72,3.81 65.91,3.81 v66.04,3.94 66.17,3.81 v87.88,3.81
  Bottom 0.254: v132.59,4.39 v137.87,4.39 | v98.58,17.83 92.99,17.83 91.67,16.51 JP15.2 | v127.91,18.72 v136.04,18.72
  Bottom 0.762: v66.04,3.94 v66.04,6.73 | v88.9,16.51 88.9,4.83 v87.88,3.81
VDD
  Top 0.254: IC8.17 181.76,22 180.9,22 180.29,22.61 178.21,22.61 177.95,22.86 C31.2 177.88,22.96 176.28,24.56 168.02,24.56 166.98,23.52 165.94,23.52 IC7.1 164.72,23.5 164.13,22.91 164.13,22.3 153.01,11.18 153.01,5.49 X1.4
VMOT  (via drill 0.51 pad 1.02)
  Top 0.254: IC1.28 v10.81,27.8 10.79,27.81 | IC1.22 v17.13,27.8 v17.14,27.81 | IC2.22 v38.72,27.8 v38.73,27.81 | IC3.28 v53.99,27.8 v53.98,27.81 | IC3.22 60.31,27.8 v60.33,27.81 | IC4.28 75.58,27.8 v75.56,27.81 | IC4.22 81.9,27.8 v81.92,27.81 | C15.1 32.16,28.8 | v32.4,27.8 IC2.28
  Top 0.762: C11.1 10.92,27.94 10.79,27.81 | C12.2 17.02,27.94 v17.14,27.81 | C33.1 6.71,17.77 6.71,21.87 6.35,22.23 6.35,26.04 7.62,27.3 v7.62,27.94 v7.62,38.73 | C16.2 38.61,27.94 v38.73,27.81 | 28.3,17.77 C35.1 28.31,21.86 27.94,22.23 27.94,26.04 29.21,27.3 v29.21,27.94 v29.21,38.73 | C19.1 54.1,27.94 v53.98,27.81 | C20.2 60.2,27.94 v60.33,27.81 | 49.89,17.77 C37.1 49.9,21.86 49.53,22.23 49.53,26.04 50.8,27.3 v50.8,27.94 v50.8,38.73 | C23.1 75.69,27.94 v75.56,27.81 | C24.2 81.79,27.94 v81.92,27.81 | 71.48,17.77 C39.1 71.49,21.86 71.12,22.23 71.12,26.04 72.39,27.3 v72.39,27.94 v72.39,38.73 | v23.62,29.08 22.54,30.16 C1.+ | v45.21,29.08 44.13,30.16 C2.+ | v66.8,29.08 65.72,30.16 C3.+ | v88.39,29.08 87.31,30.16 C4.+ | JP5.1 95.25,39.37 92.34,36.46 C26.1 93.25,26.67 IC5.1 | v32.4,27.8 32.4,28.7 C15.1
  Top 1.27: 44.13,30.16 45.72,31.75 v45.72,44.45 | 65.72,30.16 67.31,31.75 v67.31,44.45 | 87.31,30.16 88.9,31.75 v88.9,44.45 | 22.54,30.16 24.13,31.75 v24.13,44.45
  Bottom 0.254: v10.81,27.8 10.82,27.84 10.79,27.81
  Bottom 0.762: v17.14,27.81 22.35,27.81 v23.62,29.08 23.62,37.34 22.1,38.86 7.75,38.86 v7.62,38.73 | 10.79,27.81 7.75,27.81 v7.62,27.94 | v38.73,27.81 43.94,27.81 v45.21,29.08 45.21,37.34 43.69,38.86 29.34,38.86 v29.21,38.73 | v60.33,27.81 65.53,27.81 v66.8,29.08 66.8,37.34 65.28,38.86 50.93,38.86 v50.8,38.73 | v53.98,27.81 50.93,27.81 v50.8,27.94 | v81.92,27.81 87.12,27.81 v88.39,29.08 88.39,37.34 86.87,38.86 72.52,38.86 v72.39,38.73 | v75.56,27.81 72.52,27.81 v72.39,27.94 | v32.4,27.8 29.35,27.8 v29.21,27.94
  other vias: 24.13,45.72 24.13,46.99 45.72,45.72 45.72,46.99 67.31,45.72 67.31,46.99 88.9,45.72 88.9,46.99 25.4,46.99 25.4,45.72 25.4,44.45 44.45,46.99 46.99,45.72 44.45,45.72 44.45,44.45 46.99,46.99 46.99,44.45 66.04,46.99 66.04,45.72 66.04,44.45 68.58,44.45 68.58,45.72 68.58,46.99 87.63,46.99 87.63,45.72 87.63,44.45 90.17,44.45 90.17,45.72 90.17,46.99 107.95,44.45 105.41,44.45 106.68,44.45 107.95,45.72 106.68,45.72 105.41,45.72 105.41,46.99 106.68,46.99 107.95,46.99 120.65,44.45 121.92,44.45 123.19,44.45 123.19,45.72 121.92,45.72 120.65,45.72 120.65,46.99 121.92,46.99 123.19,46.99 138.43,46.99 137.16,45.72 138.43,45.72 138.43,44.45 137.16,44.45 135.89,44.45 137.16,46.99 135.89,46.99 135.89,45.72 105.41,34.29 105.41,33.02 105.41,31.75 120.65,31.75 120.65,33.02 120.65,34.29 135.89,34.29 135.89,33.02 135.89,31.75 137.16,33.02 137.16,34.29 137.16,31.75 121.92,34.29 121.92,33.02 121.92,31.75 106.68,34.29 106.68,33.02 106.68,31.75
  pour Top (no thermals): 22.86,52.07 22.86,45.72 arc90 25.4,43.18 92.71,43.18 92.71,40.64 93.98,39.37 96.52,39.37 97.79,40.64 97.79,43.18 139.7,43.18 140.97,44.45 140.97,52.07
  pour Bottom (no thermals): 140.97,50.8 22.86,50.8 22.86,44.45 24.13,43.18 92.71,43.18 92.71,40.64 93.98,39.37 96.52,39.37 97.79,40.64 97.79,43.18 104.14,43.18 104.14,30.48 109.22,30.48 109.22,38.1 107.95,39.37 107.95,41.91 109.22,43.18 119.38,43.18 119.38,30.48 124.46,30.48 124.46,38.1 123.19,39.37 123.19,41.91 124.46,43.18 134.62,43.18 134.62,30.48 139.7,30.48 139.7,38.1 138.43,39.37 138.43,41.91 140.97,44.45
  pour Top: 104.14,30.48 109.22,30.48 109.22,36.83 111.76,39.37 111.76,41.91 106.68,41.91 104.14,39.37
  pour Top: 119.38,30.48 124.46,30.48 124.46,36.83 127,39.37 127,41.91 121.92,41.91 119.38,39.37
  pour Top: 134.62,30.48 139.7,30.48 139.7,36.83 142.24,39.37 142.24,41.91 137.16,41.91 134.62,39.37
X-DIR  (via drill 0.51, 0.51 pad 1.02)
  Top 0.254: IC1.19 18.79,25.9 20.07,27.18 23.5,27.18 24.13,26.54 24.13,19.43 23.88,19.18 23.88,6.73 24.64,5.97 26.42,5.97 v27.3,5.08 | v27.3,2.54 27.43,2.54 27.94,3.05 87.38,3.05 87.5,2.92 88.27,2.92 88.39,3.05 89.46,3.05 v89.74,3.33 | v111.96,19.13 116.89,19.13 117.65,19.89 118.9,19.89 119.71,19.07 120.07,19.07 IC6.24 | v98.15,12.95 95.2,12.95 94.51,12.27 v94.49,12.27
  Bottom 0.254: v27.3,2.54 v27.3,5.08 | 94.79,12.27 v94.49,12.27 94.39,12.19 90.81,8.61 90.32,8.61 89.86,8.15 89.86,4.93 89.97,4.83 89.97,3.56 v89.74,3.33 | v111.96,19.13 110.47,19.13 103.53,12.19 98.91,12.19 v98.15,12.95
X-STEP  (via drill 0.51, 0.51 pad 1.02)
  Top 0.254: IC1.16 18.27,24.4 21.21,21.46 23.11,21.46 23.62,20.95 23.62,19.68 23.37,19.43 23.37,5.97 24.26,5.08 v25.4,5.08 | v25.4,2.54 26.04,2.54 26.92,1.65 27.69,1.65 28.57,2.54 87.12,2.54 87.25,2.41 89.94,2.41 90.12,2.59 v100.64,2.59 | v122.5,12.17 126.57,16.23 IC6.16 | v109.5,8.71 v112.95,12.17
  Bottom 0.254: v25.4,2.54 v25.4,5.08 | v112.95,12.17 v122.5,12.17 | v109.5,8.71 106.96,8.71 106.58,9.09 105.92,9.09 100.64,3.81 v100.64,2.59
X-STOP  (via drill 0.51)
  Top 0.254: C5.+ JP9.1 | v129.34,17.83 129.34,18.44 127.18,20.6 125.37,20.6 123.85,19.07 123.77,19.07 IC6.21 | v149.76,23.16 152.93,26.34 152.93,31.83 154.89,33.78 154.89,34.14 C5.+ | R1.2 155.04,34.42 C5.+
  Bottom 0.254: v129.34,17.83 138.28,17.83 143.61,23.16 v149.76,23.16
XCP1
  Top 0.254: IC1.4 9.65,25.4 9.28,25.03 C10.1
XCP2
  Top 0.254: IC1.5 10.04,24.9 8.37,23.23 C10.2
XCP3
  Top 0.254: IC2.4 31.24,25.4 30.87,25.03 C14.1
XCP4
  Top 0.254: IC2.5 31.63,24.9 29.96,23.23 C14.2
XCP5
  Top 0.254: IC3.4 52.83,25.4 52.46,25.03 C18.1
XCP6
  Top 0.254: IC3.5 53.22,24.9 51.55,23.23 C18.2
XCP7
  Top 0.254: IC4.4 74.3,25.4 73.92,25.03 C22.1
XCP8
  Top 0.254: IC4.5 74.81,24.9 73.14,23.23 C22.2
XOUT1A
  Top 0.254: IC1.24 14.47,29.73
  Top 0.762: JP1.3 15.89,40.02 14.47,38.6 14.47,29.73
XOUT1B
  Top 0.254: IC1.21 18.01,26.9 18.16,27.05
  Top 0.508: 18.16,27.05 19.05,27.94
  Top 0.762: JP1.4 19.05,40.64 19.05,27.94
XOUT2A
  Top 0.254: IC1.26 13.47,29.73
  Top 0.762: JP1.2 12.39,39.68 13.47,38.6 13.47,29.73
XOUT2B
  Top 0.254: IC1.1 10.06,26.9 9.91,27.05
  Top 0.508: 9.91,27.05 9.78,27.05 8.89,27.94
  Top 0.762: 8.89,27.94 JP1.1
XREF
  Top 0.254: IC1.17 19.39,24.9 T1.2
XREF1
  Top 0.254: IC2.17 40.98,24.9 T2.2
XREF2
  Top 0.254: T1.3 23.62,25.41 23.62,23.37 22.61,22.35 R6.2
XREF3
  Top 0.254: T2.3 45.21,25.41 45.21,23.37 44.2,22.35 R7.2
XREF4
  Top 0.254: IC3.17 62.57,24.9 T3.2
XREF5
  Top 0.254: T3.3 66.8,25.41 66.8,23.37 65.79,22.35 R8.2
XREF6
  Top 0.254: IC4.17 84.16,24.9 T4.2
XREF7
  Top 0.254: T4.3 88.39,25.41 88.39,23.37 87.38,22.35 R9.2
XROSC
  Top 0.254: R14.1 14.97,19.59 IC1.13
XROSC1
  Top 0.254: R17.1 36.56,19.59 IC2.13
XROSC2
  Top 0.254: R20.1 58.15,19.59 IC3.13
XROSC3
  Top 0.254: R23.1 79.74,19.59 IC4.13
XSENSE1
  Top 0.254: IC1.23 14.97,28.94 15.24,29.21
  Top 0.508: S2.2 16.51,32.77 15.49,31.75 15.49,29.46 15.24,29.21
XSENSE2
  Top 0.254: IC1.27 12.97,28.94 12.7,29.21
  Top 0.508: S1.2 11.43,32.77 12.45,31.75 12.45,29.46 12.7,29.21
XSENSE3
  Top 0.254: IC2.27 34.56,28.94 34.29,29.21
  Top 0.508: S3.2 33.02,32.77 34.04,31.75 34.04,29.46 34.29,29.21
XSENSE4
  Top 0.254: IC2.23 36.56,28.94 36.83,29.21
  Top 0.508: S4.2 38.1,32.77 37.08,31.75 37.08,29.46 36.83,29.21
XSENSE5
  Top 0.254: IC3.27 56.15,28.94 55.88,29.21
  Top 0.508: S5.2 54.61,32.77 55.63,31.75 55.63,29.46 55.88,29.21
XSENSE6
  Top 0.254: IC3.23 58.15,28.94 58.42,29.21
  Top 0.508: S6.2 59.69,32.77 58.67,31.75 58.67,29.46 58.42,29.21
XSENSE7
  Top 0.254: IC4.27 77.74,28.94 77.47,29.21
  Top 0.508: S7.2 76.2,32.77 77.22,31.75 77.22,29.46 77.47,29.21
XSENSE8
  Top 0.254: IC4.23 79.74,28.94 80.01,29.21
  Top 0.508: S8.2 81.28,32.77 80.26,31.75 80.26,29.46 80.01,29.21
XSLEEP
  Top 0.254: IC1.14 16.51,21.96 16.51,19.05 | 16.51,19.05 17.78,17.78 R15.2 | IC1.12 14.47,20.82 13.97,20.32 13.97,18.92 14.48,18.41 15.88,18.41 16.51,19.05
XSLEEP1
  Top 0.254: IC2.14 38.1,21.96 38.1,19.05 | 38.1,19.05 39.37,17.78 R18.2 | IC2.12 36.06,20.82 35.56,20.32 35.56,18.92 36.07,18.41 37.47,18.41 38.1,19.05
XSLEEP2
  Top 0.254: IC3.14 59.69,21.96 59.69,19.05 | 59.69,19.05 60.96,17.78 R21.2 | IC3.12 57.65,20.82 57.15,20.32 57.15,18.92 57.66,18.41 59.05,18.41 59.69,19.05
XSLEEP3
  Top 0.254: IC4.14 81.28,21.96 81.28,19.05 | 81.28,19.05 82.55,17.78 R24.2 | IC4.12 79.24,20.82 78.74,20.32 78.74,18.92 79.25,18.41 80.64,18.41 81.28,19.05
XVCP
  Top 0.254: C33.2 9.65,18.91 9.65,23.62 10.43,24.4 IC1.6
XVCP1
  Top 0.254: C35.2 31.24,18.91 31.24,23.62 32.02,24.4 IC2.6
XVCP2
  Top 0.254: C37.2 52.83,18.91 52.83,23.62 53.61,24.4 IC3.6
XVCP3
  Top 0.254: C39.2 74.42,18.91 74.42,23.62 75.2,24.4 IC4.6
XVREG
  Top 0.254: C34.2 11.05,21.58 IC1.8
XVREG1
  Top 0.254: C36.2 32.64,21.58 IC2.8
XVREG2
  Top 0.254: C38.2 54.23,21.58 IC3.8
XVREG3
  Top 0.254: C40.2 75.82,21.58 IC4.8
Y-DIR  (via drill 0.51)
  Top 0.254: IC2.19 40.38,25.9 41.66,27.18 45.09,27.18 45.72,26.54 45.72,19.43 45.47,19.18 45.47,5.84 46.23,5.08 65.02,5.08 65.28,5.33 66.8,5.33 67.06,5.08 87.38,5.08 87.5,5.21 89.92,5.21 90.02,5.28 91.67,5.28 97.33,10.95 v99.03,10.95 | v117.2,18.26 117.7,18.77 117.78,18.77 118.59,17.96 118.95,17.96 IC6.26
  Bottom 0.254: v117.2,18.26 111.63,12.7 107.95,12.7 106.2,10.95 v99.03,10.95
Y-STEP  (via drill 0.51)
  Top 0.254: IC2.16 39.86,24.4 42.8,21.46 44.7,21.46 45.21,20.95 45.21,19.68 44.96,19.43 44.96,5.59 45.97,4.57 65.41,4.57 65.66,4.83 66.42,4.83 66.67,4.57 87.5,4.57 87.63,4.7 89.92,4.7 89.99,4.6 90.47,4.12 v90.78,4.12 | v121.06,17.98 120.67,17.6 120.42,17.6 119.53,18.49 IC6.25 | v99.34,12.98 99.34,11.76 99.82,11.28 99.82,10.62 v93.83,4.62
  Bottom 0.254: v121.06,17.98 120.52,17.98 117.81,20.7 111.45,20.7 103.68,12.93 99.39,12.93 v99.34,12.98 | v93.83,4.62 93.27,4.62 92.76,4.12 v90.78,4.12
Y-STOP  (via drill 0.51, 0.51 pad 1.02)
  Top 0.254: C6.+ JP10.1 | R2.2 165.1,34.42 C6.+ | v125.27,21.77 123.22,19.71 123.22,19.63 IC6.22 | v162.56,34.29 162.6,34.25 C6.+
  Bottom 0.254: v125.27,21.77 140.44,21.77 145.39,26.72 160.91,26.72 162.56,28.37 v162.56,34.29
YOUT1A
  Top 0.254: IC2.24 36.06,29.73
  Top 0.762: JP2.3 37.48,40.02 36.06,38.6 36.06,29.73
YOUT1B
  Top 0.254: IC2.21 39.6,26.9 39.75,27.05
  Top 0.508: 39.75,27.05 40.64,27.94
  Top 0.762: JP2.4 40.64,40.64 40.64,27.94
YOUT2A
  Top 0.254: IC2.26 35.06,29.73
  Top 0.762: JP2.2 33.98,39.68 35.06,38.6 35.06,29.73
YOUT2B
  Top 0.254: IC2.1 31.65,26.9 31.5,27.05
  Top 0.508: 31.5,27.05 31.37,27.05 30.48,27.94
  Top 0.762: 30.48,27.94 JP2.1
Z-DIR  (via drill 0.51)
  Top 0.254: IC3.19 61.97,25.9 63.25,27.18 66.67,27.18 67.31,26.54 67.31,19.43 67.06,19.18 67.06,7.75 67.44,7.37 67.44,6.99 67.82,6.6 87,6.6 87.12,6.73 89.66,6.73 | 89.66,6.73 89.92,6.73 | v113.72,5.89 118.19,5.89 119.18,6.88 119.51,6.88 IC6.42 | v90.65,7.82 89.66,6.83 89.66,6.73
  Bottom 0.254: v113.72,5.89 113.44,5.89 109.83,9.5 92.33,9.5 v90.65,7.82
Z-STEP  (via drill 0.51)
  Top 0.254: IC3.16 61.45,24.4 64.39,21.46 66.29,21.46 66.8,20.95 66.8,19.68 66.55,19.43 66.55,7.49 66.93,7.11 66.93,6.73 67.56,6.1 87.12,6.1 87.25,6.22 90.02,6.22 90.27,6.48 90.55,6.48 v90.7,6.63 | v92.43,4.9 93.95,3.38 116.84,3.38 119.79,6.33 120.07,6.33 IC6.43
  Bottom 0.254: v90.7,6.63 v92.43,4.9
Z-STOP  (via drill 0.51, 0.51 pad 1.02)
  Top 0.254: C7.+ JP11.1 | R3.2 175.26,34.42 C7.+ | IC6.23 121.28,19.63 122.94,21.29 v122.94,22.55 | v171.96,34.29 175.22,34.29 C7.+
  Bottom 0.254: v122.94,22.55 140.64,22.55 145.21,27.13 151.16,27.13 159.21,27.13 161.54,29.46 161.54,34.8 162.31,35.56 170.69,35.56 v171.96,34.29
ZOUT1A
  Top 0.254: IC3.24 57.65,29.73
  Top 0.762: JP3.3 59.07,40.02 57.65,38.6 57.65,29.73
ZOUT1B
  Top 0.254: IC3.21 61.19,26.9 61.34,27.05
  Top 0.508: 61.34,27.05 62.23,27.94
  Top 0.762: JP3.4 62.23,40.64 62.23,27.94
ZOUT2A
  Top 0.254: IC3.26 56.65,29.73
  Top 0.762: JP3.2 55.57,39.68 56.65,38.6 56.65,29.73
ZOUT2B
  Top 0.254: IC3.1 53.24,26.9 53.09,27.05
  Top 0.508: 53.09,27.05 52.96,27.05 52.07,27.94
  Top 0.762: 52.07,27.94 JP3.1

## Text on the board
_tsilk: POWER | HOTBED | HOTEND | FAN | X-MOTOR | Y-MOTOR | Z-MOTOR | E-MOTOR | XSTOP | YSTOP | ZSTOP | BTEMP | ETEMP | 12-30V | GND | PWR | GND | PWR | GND | PWR | GND | http://reprap.org/wiki/Melzi | C1 | C2 | C3 | C4 | S1 | S2 | S3 | S4 | S5 | S6 | S7 | S8 | R1 | R2 | R3 | R4 | R5 | C5 | C6 | C7 | C8 | C9 | C11 | C12 | C15 | C16 | C19 | C20 | C23 | C24 | T1 | T2 | T3 | T4 | LM7805 VREG | C26 | C28 | M1 | C29 | M2 | C30 | M3 | C27 | R10 | R11 | R12 | C32 | C31 | C10 | C14 | C18 | C22 | A4988 | A4988 | A4988 | A4988 | A4988 | A4988 | BYPASS | BYPASS | BYPASS | C13 | R6 | C17 | R7 | C21 | R8 | C25 | R9 | STATUS | C33 | R15 | C35 | R18 | C37 | R21 | C39 | R24 | AUTO-RESET | C34 | R14 | C36 | R17 | C38 | R20 | C40 | R23 | 4050D | VREG | L1 | R25 | C41 | C42 | C43 | FTDI FT232RL | R13 | R16 | F19 | R22 | C44 | C45 | USB | PWR-SEL | ATMEGA644 | MS1 | MS2 | MS3 | MS1 | MS2 | MS3 | MS1 | MS2 | MS3 | MS1 | MS2 | MS3 | Q1 16MHz | D10 | D11 | D16 | D17 | Melzi Ardentissimo | Based on Sanguinololu | 5V | RX1 | TX1 | SCL | SDA | RESET | SCK | MISO | R26 | Designed for | RepRapPro.com | USB | EXT | ISP | RESET | MICRO-SD | GND | A4 | A3 | A2 | A1 | GND | MOSI | 5V